# Altium schematic sheet MCU.SchDoc: MCU
size A; DocumentNumber: 9; SheetNumber: 9; SheetTotal: 9
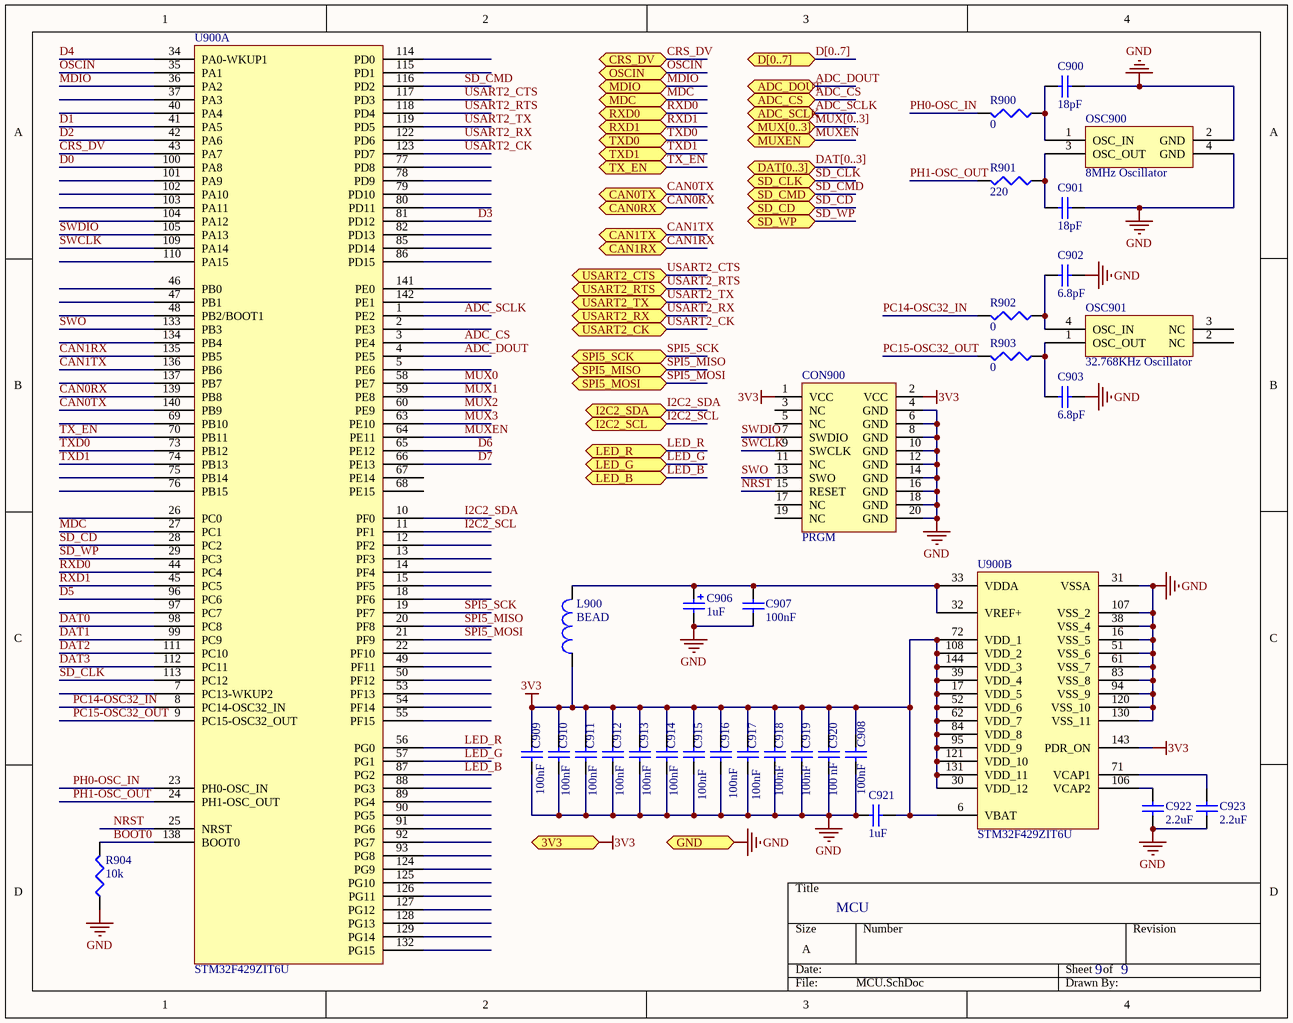
[diagram p0: MCU.SchDoc]

## Parts
C900  value 18pF  [SMD0603]  (hidden comment: Cap)
C901  value 18pF  [SMD0603]  (hidden comment: Cap)
C902  value 6.8pF  [SMD0603]  (hidden comment: Cap)
C903  value 6.8pF  [SMD0603]  (hidden comment: Cap)
C906  value 1uF  [SMD1206 Polarized]  (hidden comment: Cap)
C907  value 100nF  [SMD0603]  (hidden comment: Cap)
C908  value 100nF  [SMD0603]  (hidden comment: Cap)
C909  value 100nF  [SMD0603]  (hidden comment: Cap)
C910  value 100nF  [SMD0603]  (hidden comment: Cap)
C911  value 100nF  [SMD0603]  (hidden comment: Cap)
C912  value 100nF  [SMD0603]  (hidden comment: Cap)
C913  value 100nF  [SMD0603]  (hidden comment: Cap)
C914  value 100nF  [SMD0603]  (hidden comment: Cap)
C915  value 100nF  [SMD0603]  (hidden comment: Cap)
C916  value 100nF  [SMD0603]  (hidden comment: Cap)
C917  value 100nF  [SMD0603]  (hidden comment: Cap)
C918  value 100nF  [SMD0603]  (hidden comment: Cap)
C919  value 100nF  [SMD0603]  (hidden comment: Cap)
C920  value 100 nF  [SMD0603]  (hidden comment: Cap)
C921  value 1uF  [SMD0805]  (hidden comment: Cap)
C922  value 2.2uF  [SMD1206]  (hidden comment: Cap)
C923  value 2.2uF  [SMD1206]  (hidden comment: Cap)
CON900  PRGM  [JTAG/SWO-20PIN]
L900  BEAD  [SMD0603]
OSC900  8MHz Oscillator  [ABMM2-OSC]
OSC901  32.768KHz Oscillator  [MC-306-OSC]
R900  value 0  [SMD0603]  (hidden comment: Res)
R901  value 220  [SMD0603]  (hidden comment: Res)
R902  value 0  [SMD0603]  (hidden comment: Res)
R903  value 0  [SMD0603]  (hidden comment: Res)
R904  value 10k  [SMD0603]  (hidden comment: Res)
U900  STM32F429ZIT6U  [LQPF144]  (parts A,B of 2)

## Ports
3V3, ADC_CS, ADC_DOUT, ADC_SCLK, CAN0RX, CAN0TX, CAN1RX, CAN1TX, CRS_DV, D[0..7], DAT[0..3], GND, I2C2_SCL, I2C2_SDA, LED_B, LED_G, LED_R, MDC, MDIO, MUX[0..3], MUXEN, OSCIN, RXD0, RXD1, SD_CD, SD_CLK, SD_CMD, SD_WP, SPI5_MISO, SPI5_MOSI, SPI5_SCK, TX_EN, TXD0, TXD1, USART2_CK, USART2_CTS, USART2_RTS, USART2_RX, USART2_TX

## Nets
3V3: C908.1 C909.2 C910.2 C911.2 C912.2 C913.2 C914.2 C915.2 C916.2 C917.2 C918.2 C919.2 C920.2 C921.1 CON900.1(VCC) CON900.2(VCC) L900.1 U900.6(VBAT) U900.17(VDD_5) U900.30(VDD_12) U900.39(VDD_4) U900.52(VDD_6) U900.62(VDD_7) U900.72(VDD_1) U900.84(VDD_8) U900.95(VDD_9) U900.108(VDD_2) U900.121(VDD_10) U900.131(VDD_11) U900.143(PDR_ON) U900.144(VDD_3) ; port 3V3
GND: C900.1 C901.1 C902.1 C903.1 C906.2 C907.2 C908.2 C909.1 C910.1 C911.1 C912.1 C913.1 C914.1 C915.1 C916.1 C917.1 C918.1 C919.1 C920.1 C921.2 C922.1 C923.1 CON900.4(GND) CON900.6(GND) CON900.8(GND) CON900.10(GND) CON900.12(GND) CON900.14(GND) CON900.16(GND) CON900.18(GND) CON900.20(GND) OSC900.2(GND) OSC900.4(GND) R904.1 U900.16(VSS_5) U900.31(VSSA) U900.38(VSS_4) U900.51(VSS_6) U900.61(VSS_7) U900.83(VSS_8) U900.94(VSS_9) U900.107(VSS_2) U900.120(VSS_10) U900.130(VSS_11) ; port GND
ADC_CS: U900.3(PE4) ; port ADC_CS
ADC_DOUT: U900.4(PE5) ; port ADC_DOUT
ADC_SCLK: U900.1(PE2) ; port ADC_SCLK
BOOT0: R904.2 U900.138(BOOT0)
CAN0RX: U900.139(PB8) ; port CAN0RX
CAN0TX: U900.140(PB9) ; port CAN0TX
CAN1RX: U900.135(PB5) ; port CAN1RX
CAN1TX: U900.136(PB6) ; port CAN1TX
CRS_DV: U900.43(PA7) ; port CRS_DV
D0: U900.100(PA8)
D1: U900.41(PA5)
D2: U900.42(PA6)
D3: U900.81(PD12)
D4: U900.34(PA0-WKUP1)
D5: U900.96(PC6)
D6: U900.65(PE12)
D7: U900.66(PE13)
DAT0: U900.98(PC8)
DAT1: U900.99(PC9)
DAT2: U900.111(PC10)
DAT3: U900.112(PC11)
I2C2_SCL: U900.11(PF1) ; port I2C2_SCL
I2C2_SDA: U900.10(PF0) ; port I2C2_SDA
LED_B: U900.87(PG2) ; port LED_B
LED_G: U900.57(PG1) ; port LED_G
LED_R: U900.56(PG0) ; port LED_R
MDC: U900.27(PC1) ; port MDC
MDIO: U900.36(PA2) ; port MDIO
MUX0: U900.58(PE7)
MUX1: U900.59(PE8)
MUX2: U900.60(PE9)
MUX3: U900.63(PE10)
MUXEN: U900.64(PE11) ; port MUXEN
NRST: CON900.15(RESET) U900.25(NRST)
OSCIN: U900.35(PA1) ; port OSCIN
PC14-OSC32_IN: R902.2 U900.8(PC14-OSC32_IN)
PC15-OSC32_OUT: R903.2 U900.9(PC15-OSC32_OUT)
PH0-OSC_IN: R900.2 U900.23(PH0-OSC_IN)
PH1-OSC_OUT: R901.2 U900.24(PH1-OSC_OUT)
RXD0: U900.44(PC4) ; port RXD0
RXD1: U900.45(PC5) ; port RXD1
SD_CD: U900.28(PC2) ; port SD_CD
SD_CLK: U900.113(PC12) ; port SD_CLK
SD_CMD: U900.116(PD2) ; port SD_CMD
SD_WP: U900.29(PC3) ; port SD_WP
SPI5_MISO: U900.20(PF8) ; port SPI5_MISO
SPI5_MOSI: U900.21(PF9) ; port SPI5_MOSI
SPI5_SCK: U900.19(PF7) ; port SPI5_SCK
SWCLK: CON900.9(SWCLK) U900.109(PA14)
SWDIO: CON900.7(SWDIO) U900.105(PA13)
SWO: CON900.13(SWO) U900.133(PB3)
TX_EN: U900.70(PB11) ; port TX_EN
TXD0: U900.73(PB12) ; port TXD0
TXD1: U900.74(PB13) ; port TXD1
USART2_CK: U900.123(PD7) ; port USART2_CK
USART2_CTS: U900.117(PD3) ; port USART2_CTS
USART2_RTS: U900.118(PD4) ; port USART2_RTS
USART2_RX: U900.122(PD6) ; port USART2_RX
USART2_TX: U900.119(PD5) ; port USART2_TX
NetC900_2: C900.2 OSC900.1(OSC_IN) R900.1
NetC901_2: C901.2 OSC900.3(OSC_OUT) R901.1
NetC902_2: C902.2 OSC901.4(OSC_IN) R902.1
NetC903_2: C903.2 OSC901.1(OSC_OUT) R903.1
NetC906_1: C906.1 C907.1 L900.2 U900.32(VREF+) U900.33(VDDA)
NetC922_2: C922.2 U900.106(VCAP2)
NetC923_2: C923.2 U900.71(VCAP1)

Not connected (* = marked no-connect by the designer): CON900 3(NC) 5(NC) 11(NC) 17(NC) 19(NC); OSC901 2(NC) 3(NC); U900 2(PE3) 5(PE6) 7(PC13-WKUP2) 12(PF2) 13(PF3) 14(PF4) 15(PF5) 18(PF6) 22(PF10) 26(PC0) 37(PA3) 40(PA4) 46(PB0) 47(PB1) 48(PB2/BOOT1) 49(PF11) 50(PF12) 53(PF13) 54(PF14) 55(PF15) 67(PE14) 68(PE15) 69(PB10) 75(PB14) 76(PB15) 77(PD8) 78(PD9) 79(PD10) 80(PD11) 82(PD13) 85(PD14) 86(PD15) 88(PG3) 89(PG4) 90(PG5) 91(PG6) 92(PG7) 93(PG8) 97(PC7) 101(PA9) 102(PA10) 103(PA11) 104(PA12) 110(PA15) 114(PD0) 115(PD1) 124(PG9) 125(PG10) 126(PG11) 127(PG12) 128(PG13) 129(PG14) 132(PG15) 134(PB4) 137(PB7) 141(PE0) 142(PE1)

## Buses and harness runs
bus D[0..7] = port D[0..7]
bus DAT[0..3] = port DAT[0..3]
bus MUX[0..3] = port MUX[0..3]

## Library data of the parts
C900-C903 C907-C923 = Capacitor Ceramic: Ceramic Chip Capacitor
C906 = Capacitor Polarized: Polarized Capacitor (Surface Mount)
CON900 = JTAG/SWO-20PIN
L900 = Chip Ferrite Bead: Ferrite Bead; Part: BK1608HS601-TV
OSC900 = ABMM2-8.000MHZ-E2-T
OSC901 = MC-306 32.768K-E3: 32.7680kHz Oscillator
R900-R904 = Resistor